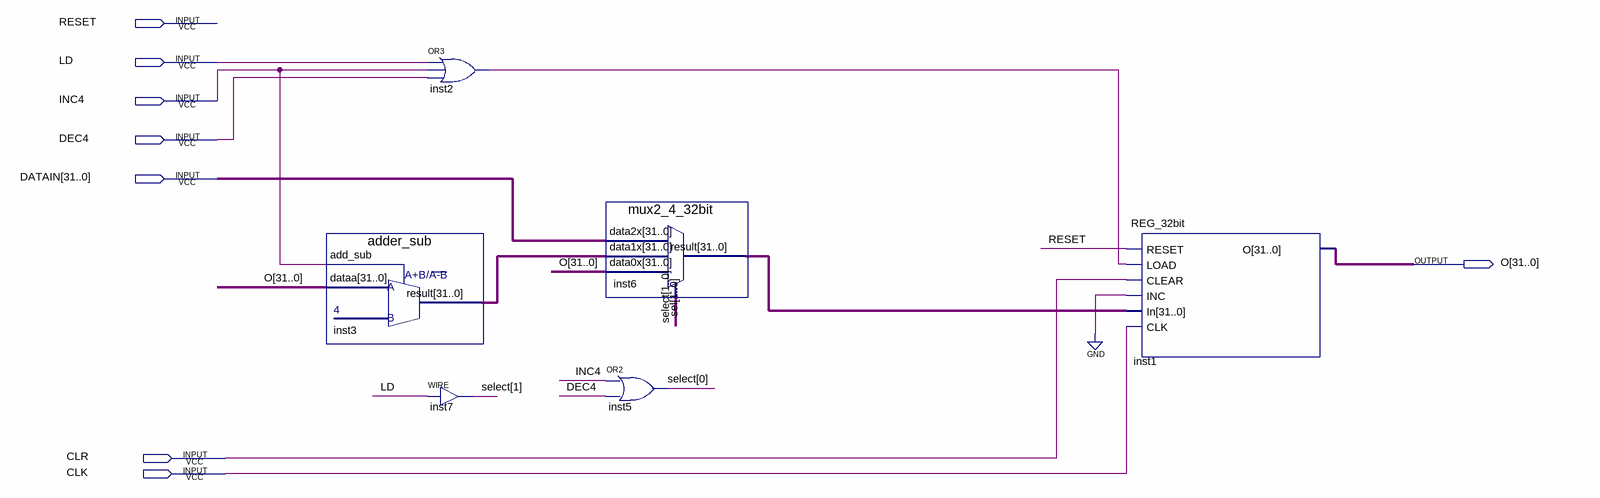
[diagram p0: schematic sheet]
// Quartus schematic SP_REG_32bit.bdf as structural Verilog: 6 symbols, 8 pins
module SP_REG_32bit (
  input  RESET,
  input  LD,
  input  INC4,
  input  DEC4,
  input  [31:0] DATAIN,
  input  CLR,
  input  CLK,
  output [31:0] O
);

  wire inst2_out;
  wire [1:0] select;
  wire [31:0] inst3_result, inst6_result;

  adder_sub inst3 (.add_sub(INC4), .dataa(O), .result(inst3_result));
  or inst2 (inst2_out, LD, INC4, DEC4);
  assign select[1] = LD;  // WIRE inst7
  mux2_4_32bit inst6 (.data2x(DATAIN), .data1x(inst3_result), .data0x(O), .sel(select), .result(inst6_result));
  or inst5 (select[0], INC4, DEC4);
  REG_32bit inst1 (.RESET(RESET), .LOAD(inst2_out), .CLEAR(CLR), .INC(1'b0), .In(inst6_result), .CLK(CLK), .O(O));
endmodule
